# EAGLE design TempestShockerUpper_V2 (EAGLE 6.6.0)
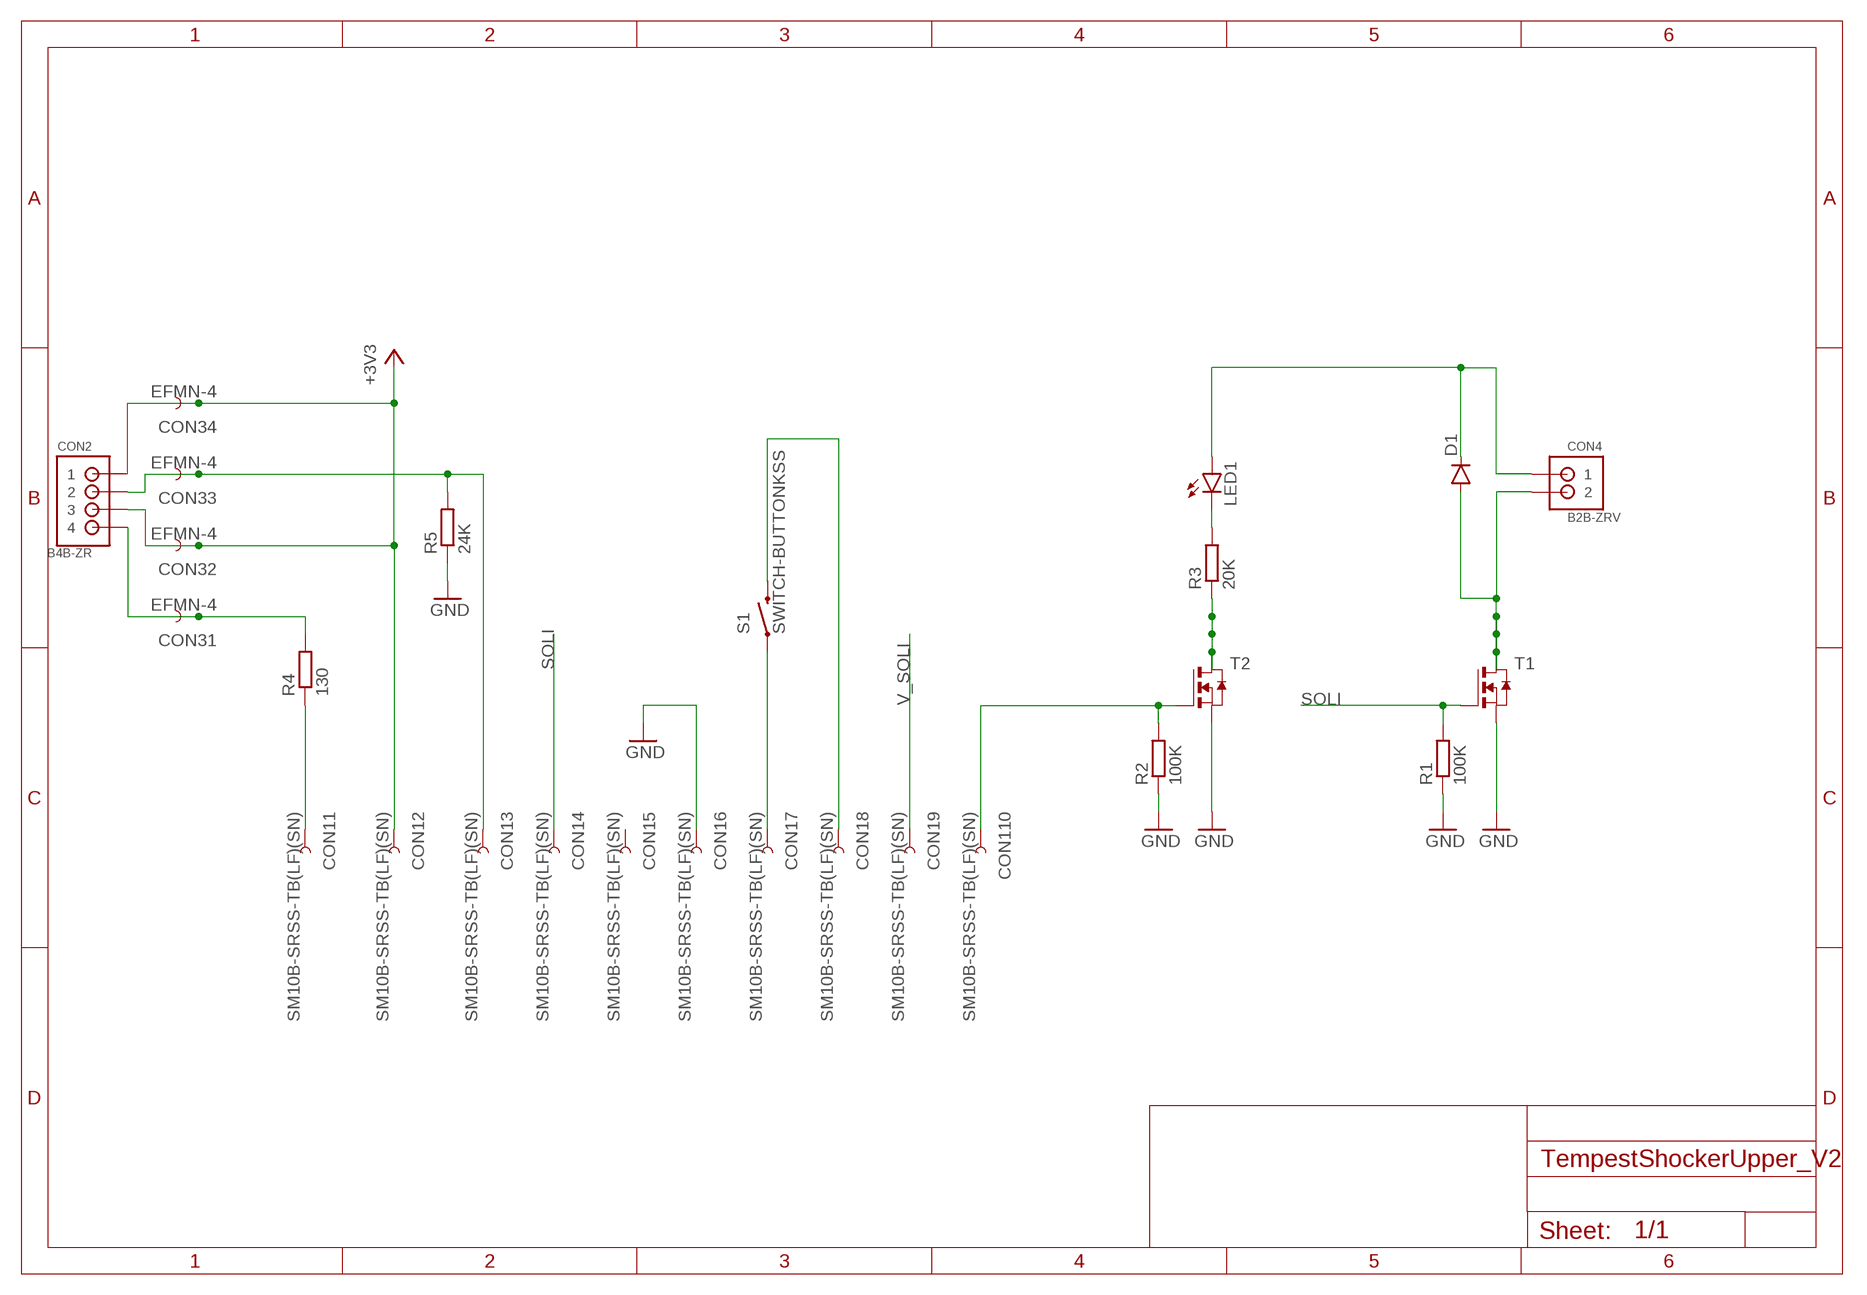
[diagram p0: schematic, sheet 1]

## Parts
CON1  SM10B-SRSS-TB(LF)(SN)  [SM10B-SRSS-TB]
CON2  B4B-ZR  [S4B-ZR]
CON3  EFMN-4  [EFMN-4]
CON4  B2B-ZRV  [S2B-ZR-VERT]
D1  DIODE-SSOD123  [SOD-123]
LED1  LED0603  [LED-0603]
R1  100K  R0603  [_0603MP]
R2  100K  R0603  [_0603MP]
R3  20K  R0603  [_0603MP]
R4  130  R0603  [_0603MP]
R5  24K  R0603  [_0603MP]
S1  SWITCH-BUTTONKSS  [KSS]
T1  NMOSSOT23-6  [SOT23-6]
T2  NMOSSOT23-6  [SOT23-6]

## Nets
+3V3: CON1.2 CON2.1 CON2.3 CON3.2 CON3.4
GND: CON1.6 R1.1 R2.1 R5.1 T1.4(S) T2.4(S)
N$1: CON2.4 CON3.1 R4.2
N$2: CON1.1 R4.1
N$3: CON1.3 CON2.2 CON3.3 R5.2
N$4: CON1.10 R2.2 T2.3(G)
N$5: CON1.7 S1.1
N$6: CON1.8 S1.2
N$7: LED1.C R3.2
N$8: R3.1 T2.1(D) T2.2(D1) T2.5(D2) T2.6(D3)
N$10: CON4.2 D1.A T1.1(D) T1.2(D1) T1.5(D2) T1.6(D3)
SOLI: CON1.4 R1.2 T1.3(G)
V_SOLI: CON1.9 CON4.1 D1.C LED1.A
Unconnected: CON1.5

## Library data of the parts
CON1 = squirrel:SM10B-SRSS-TB(LF)(SN)
CON2 = squirrel:B4B-ZR: JST-ZH Connector 4 pol, 1.5mm pitch Package: B4B-ZR Source: http://www.jst-mfg.com/product/pdf/eng/eZH.pdf
CON3 = squirrel:EFMN-4
CON4 = squirrel:B2B-ZR
D1 = squirrel:DIODE-S: Diode These are standard reverse protection diodes and small signal diodes. SMA package can handle up to about 1A. SOD-323 can handle about 200mA. What the SOD-323 package when ordering, there are some mfgs out there that are 5-pin packages.
LED1 = SparkFun-LED:LED: LEDs Standard schematic elements and footprints for 5mm, 3mm, 1206, and 0603 sized LEDs. 5mm - Spark Fun Electronics SKU : COM-00529 (and others)
R1-R5 = squirrel:R
S1 = squirrel:SWITCH-BUTTON: Various NO switches- pushbuttons, reed, etc
T1 T2 = squirrel:NMOSSOT23-6: MOS FET

## Board
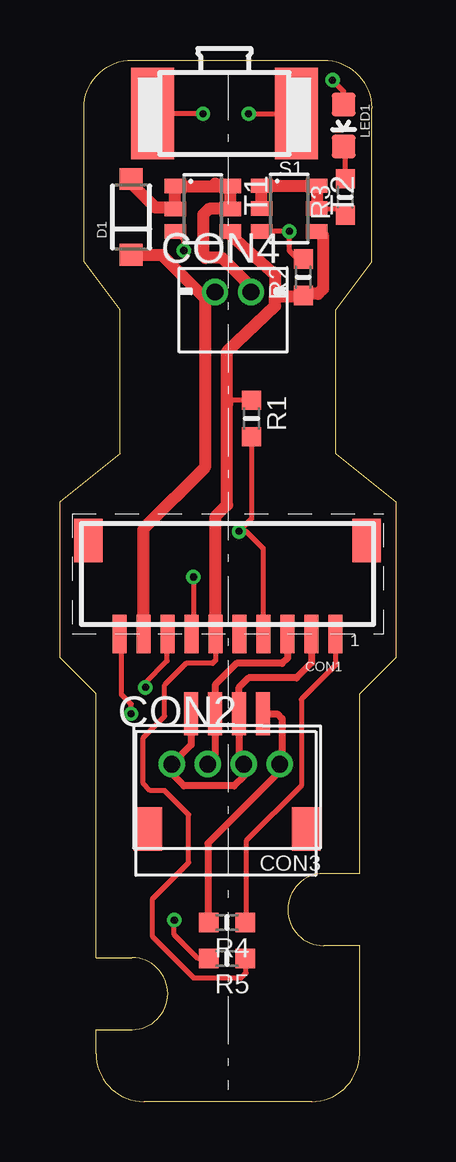
[diagram p1: board, top side]
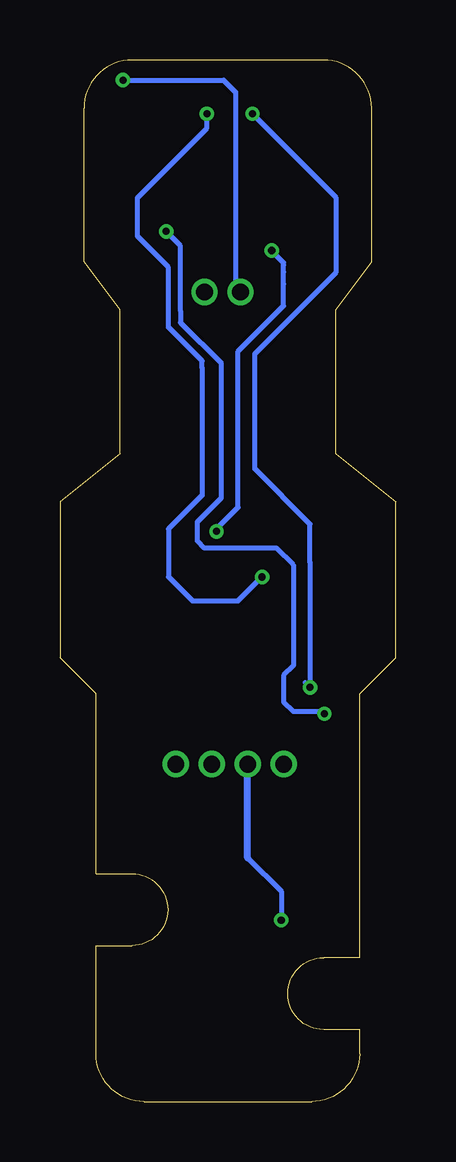
[diagram p2: board, bottom side, seen from below]

Size 14 x 43.4 mm. Coordinates in mm from the lower left corner, seen from the top.
Copper layers (1*16): Top 0.035mm / dielectric 1.5mm / Bottom 0.035mm
Design rules "PCB-POOL Standard": minimum track width 0.15mm, minimum drill 0.3mm, track to track 0.15mm, track to pad 0.15mm, pad to pad 0.15mm, via to via 0.15mm, smd to smd 0.15mm, copper to edge 0.3mm, drill to drill 0.2mm, minimum pad ring 0.2mm, minimum via ring 0.15mm, stop-mask expansion 0.075mm, vias tented up to drill 0mil, thermal gap 0.2mm

### Footprints (pad centres in the part's own frame; a part is rotated, then mirrored left to right if it is on the bottom)
SM10B-SRSS-TB = smd 0.6 x 1.6: 1 -4.5,0; 2 -3.5,0; 3 -2.5,0; 4 -1.5,0; 5 -0.5,0; 6 0.5,0; 7 1.5,0; 8 2.5,0; 9 3.5,0; 10 4.5,0 | smd 1.2 x 1.8: MNT1 5.8,-3.9; MNT2 -5.8,-3.9
S4B-ZR = drill 0.7: 1 1.5,-1.3; 2 3,-1.3; 3 4.5,-1.3; 4 6,-1.3
EFMN-4 = smd 0.6 x 1.8: 1 0,0; 2 1,0; 3 2,0; 4 3,0 | smd 1.2 x 1.8: P$5 -1.8,4.8; P$6 4.8,4.8
S2B-ZR-VERT = drill 0.7 pad 1.1: 1 0,-0.03; 2 1.5,-0.03
SOD-123 = smd 0.9 x 0.95: A 1.575,0; C -1.575,0
LED-0603 = smd 1 x 1: A 0,-0.877; C 0,0.877
_0603MP = smd 0.8 x 0.8: 1 -0.762,0; 2 0.762,0
KSS = smd 1.8 x 3.8: 1 0.9,1.9; 2 6.9,1.9
SOT23-6 = smd 0.6 x 0.9: 1 -0.95,-1.15; 2 0,-1.15; 3 0.95,-1.15; 4 0.95,1.15; 5 0,1.15; 6 -0.95,1.15

### Placement (x,y rotation side)
CON1  6.99,19.48 180 top
CON2  3.17,15.36 0 top
CON3  8.47,16.16 180 top
CON4  6.47,33.76 0 top
D1  2.97,36.86 90 top
LED1  11.83,40.67 180 top
R1  7.99,28.46 270 top
R2  10.15,34.35 90 top
R3  11.9,37.69 90 top
R4  6.97,7.46 180 top
R5  6.97,5.96 180 top
S1  10.76,43.07 180 top
T1  5.96,37.2 270 top
T2  9.56,37.21 270 top
U$2  [SHOCKER-OUTLINE-UPPER-SHORT]  -0.03,0.06 0 top

### Tracks (layer width: path | path; a pad name or v marks a point on that pad's centre or on a via)
+3V3
  Top 0.3: CON1.2 10.49,18.28 9.87,17.66 7.87,17.66 7.47,17.26 CON3.2 | CON3.2 7.47,14.36 | 7.47,14.36 CON2.3 | CON3.4 5.47,14.86 CON2.1 4.67,13.66 4.97,13.36 5.17,13.16 7.27,13.16 7.67,13.56 CON2.3 | CON3.2 7.47,14.36 | 7.47,14.36 CON2.3
GND
  Top 0.2: CON1.6 6.49,18.38 6.37,18.26 5.27,18.26 4.37,17.36 4.37,16.06 3.47,15.16 3.47,13.26 3.77,12.96 4.37,12.96 5.37,11.96 5.37,9.96 3.87,8.46 3.87,6.86 5.57,5.16 7.57,5.16 7.77,5.36 7.77,5.92 R5.1 | R1.1 7.13,29.22 6.97,29.06
  Top 0.5: CON1.6 6.49,24.38 6.97,24.86 6.97,29.06 6.97,31.26 8.97,33.16 8.97,33.56 | T1.4 7.17,36.19 7.17,36.06 8.97,34.46 8.97,33.56 | 10.77,36.2 T2.4 10.77,36.26 10.97,36.06 10.97,33.86 10.77,33.66 10.22,33.66 R2.1 10.12,33.56 8.97,33.56
N$1
  Top 0.3: CON3.1 9.07,16.16 9.27,15.96 9.27,14.26 CON2.4 9.17,13.76 6.17,10.76 6.17,7.5 R4.2
N$2
  Top 0.2: CON1.1 11.49,18.18 10.57,17.26 10.07,16.76 10.07,13.16 7.77,10.86 7.77,7.5 R4.1
N$3  (via drill 0.3)
  Top 0.2: R5.2 5.77,5.96 4.77,6.96 v4.77,7.56
  Top 0.3: CON1.3 9.49,18.48 9.27,18.26 7.37,18.26 6.47,17.36 CON3.3 6.47,14.46 CON2.2
  Bottom 0.2: 6.17,10.16 4.77,8.76 v4.77,7.56
  Bottom 0.3: 6.17,10.16 CON2.2
N$4  (via drill 0.3)
  Top 0.2: v2.97,16.16 2.97,16.56 2.57,16.96 2.57,19.4 CON1.10 | T2.3 v9.57,36.26 9.57,35.46 10.05,34.98 R2.2
  Bottom 0.2: v2.97,16.16 3.07,16.26 4.27,16.26 4.67,16.66 4.67,17.76 4.27,18.16 4.27,22.36 4.97,23.06 7.97,23.06 8.27,23.36 8.27,24.16 7.27,25.16 7.27,30.76 8.97,32.46 8.97,32.96 8.97,35.66 v9.57,36.26
N$5  (via drill 0.3)
  Top 0.2: v5.57,21.86 5.57,19.56 CON1.7 | v7.87,41.16 S1.1
  Bottom 0.2: v5.57,21.86 6.57,20.86 8.47,20.86 9.47,21.86 9.47,23.86 8.07,25.26 8.07,30.56 8.07,30.86 9.47,32.26 9.47,34.76 10.77,36.06 10.77,37.66 9.37,39.06 7.87,40.56 v7.87,41.16
N$6  (via drill 0.3)
  Top 0.2: v3.57,17.26 3.57,17.46 4.47,18.36 4.47,19.46 CON1.8 | v5.97,41.16 S1.2
  Bottom 0.2: 3.77,17.46 v3.57,17.26 3.57,22.46 3.57,24.06 5.87,26.36 5.87,30.36 5.87,31.16 2.47,34.56 2.47,37.66 v5.97,41.16
N$7
  Top 0.2: R3.2 11.9,39.82 arc90 LED1.C
N$8
  Top 0.2: T2.5 11.62,37.21 arc-90 R3.1
  Top 0.5: T2.2 T2.1 T2.6 T2.5
N$10
  Top 0.5: 6.37,38.15 T1.1 T1.2 4.75,37.26 3.97,37.26 3.73,37.5 2.97,38.26 D1.A | 6.37,38.15 T1.6 T1.5 6.21,37.2 5.97,36.96 5.97,35.33 5.97,35.26 6.07,35.16 6.77,35.16 7.97,33.96 CON4.2 | 6.47,38.25 6.37,38.15
SOLI  (via drill 0.3)
  Top 0.2: CON1.4 8.47,19.5 8.47,23.06 7.77,23.76 v7.47,23.76 7.99,24.28 R1.2 | v5.17,35.46 5.17,35.89 T1.3
  Bottom 0.2: v7.47,23.76 7.47,23.86 6.67,24.66 6.57,24.76 6.57,31.26 4.67,33.16 4.67,34.06 4.67,34.56 4.67,34.86 4.67,34.96 v5.17,35.46
V_SOLI  (via drill 0.3)
  Top 0.2: LED1.A 11.83,42.1 v11.37,42.56
  Top 0.5: CON1.9 3.49,23.88 6.07,26.46 6.07,33.46 | 6.07,33.46 6.44,33.76 CON4.1 | D1.C 4.25,35.29 6.07,33.46
  Bottom 0.2: v11.37,42.56 7.17,42.56 6.67,42.06 6.67,33.93 CON4.1